# Altium schematic sheet H01R0_Frontend 1.SchDoc
size Letter; CompanyName: Hexabitz; DocumentNumber: 2; SheetNumber: 2; SheetTotal: 3
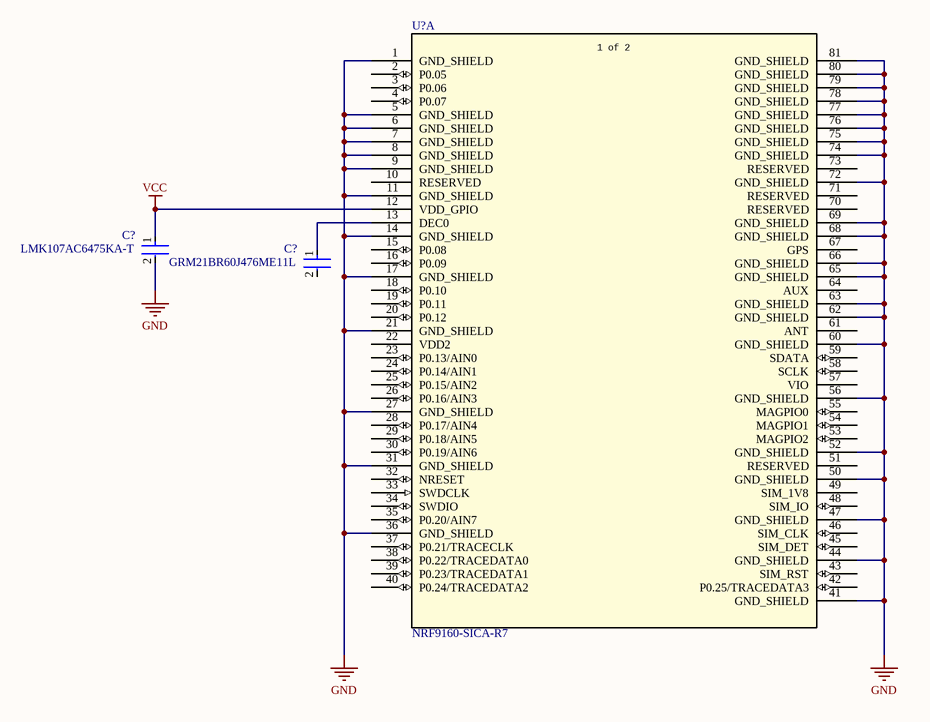
[diagram p0: H01R0_Frontend 1.SchDoc]

## Parts
(Parts that share a designator on the sheet are numbered #1, #2 ... from top to bottom, then left to right.)
C?#1  LMK107AC6475KA-T  [FP-0603-L_1_6_0_15-W_0_8-MFG]
C?#2  GRM21BR60J476ME11L  [FP-GRM21B-0_2-e0_2_0_7-IPC_B]
U?  NRF9160-SICA-R7  [LGA127_16p00X10p50_nRF9160_NOR]  (part A of 2)

## Nets
GND: C?#1.2 U?.1(GND_SHIELD) U?.5(GND_SHIELD) U?.6(GND_SHIELD) U?.7(GND_SHIELD) U?.8(GND_SHIELD) U?.9(GND_SHIELD) U?.11(GND_SHIELD) U?.14(GND_SHIELD) U?.17(GND_SHIELD) U?.21(GND_SHIELD) U?.27(GND_SHIELD) U?.31(GND_SHIELD) U?.36(GND_SHIELD) U?.41(GND_SHIELD) U?.44(GND_SHIELD) U?.47(GND_SHIELD) U?.50(GND_SHIELD) U?.52(GND_SHIELD) U?.56(GND_SHIELD) U?.60(GND_SHIELD) U?.62(GND_SHIELD) U?.63(GND_SHIELD) U?.65(GND_SHIELD) U?.66(GND_SHIELD) U?.68(GND_SHIELD) U?.69(GND_SHIELD) U?.72(GND_SHIELD) U?.74(GND_SHIELD) U?.75(GND_SHIELD) U?.76(GND_SHIELD) U?.77(GND_SHIELD) U?.78(GND_SHIELD) U?.79(GND_SHIELD) U?.80(GND_SHIELD) U?.81(GND_SHIELD)
VCC: C?#1.1 U?.12(VDD_GPIO)
NetC?#2_1: C?#2.1 U?.13(DEC0)

Not connected (* = marked no-connect by the designer): C?#2 2; U? 2(P0.05) 3(P0.06) 4(P0.07) 10(RESERVED) 15(P0.08) 16(P0.09) 18(P0.10) 19(P0.11) 20(P0.12) 22(VDD2) 23(P0.13/AIN0) 24(P0.14/AIN1) 25(P0.15/AIN2) 26(P0.16/AIN3) 28(P0.17/AIN4) 29(P0.18/AIN5) 30(P0.19/AIN6) 32(NRESET) 33(SWDCLK) 34(SWDIO) 35(P0.20/AIN7) 37(P0.21/TRACECLK) 38(P0.22/TRACEDATA0) 39(P0.23/TRACEDATA1) 40(P0.24/TRACEDATA2) 42(P0.25/TRACEDATA3) 43(SIM_RST) 45(SIM_DET) 46(SIM_CLK) 48(SIM_IO) 49(SIM_1V8) 51(RESERVED) 53(MAGPIO2) 54(MAGPIO1) 55(MAGPIO0) 57(VIO) 58(SCLK) 59(SDATA) 61(ANT) 64(AUX) 67(GPS) 70(RESERVED) 71(RESERVED) 73(RESERVED)

## Notes on the sheet
- Module:
- Title:
- Description:
- Size:
- Revision:
- Letter
- www.hexabitz.com
- Date:
- Time:
- Sheet
- of
- (in symbol CMP-006-000000-1, part A) 1 of 2

## Library data of the parts
C?#1 = CMP-14477-003024-3: Ceramic Capacitor General Use 4.7uF ±10% 10V X6S 0603; NexarPartId: 75346097; Capacitance: 4.7µF; Material: Ceramic; Voltage Rating (DC): 10V; Case/Package: 0603; Height: 950µm; Max Operating Temperature: 105°C; RoHS: Non-Compliant; Tolerance: 10%; Min Operating Temperature: -55°C; Voltage Rating: 10V
C?#2 = CMP-06035-028650-1: Chip Multilayer Ceramic Capacitors for General Purpose, 0805, 47uF, X5R, 15%, 20%, 6.3V; Tolerance: 20%; Case/Package: 0805; Length: 2mm; Thickness: 1.25mm; Dielectric: X5R; Width: 1.25mm; Capacitance: 47uF; Voltage Rating (DC): 6.3V
U? = CMP-006-000000-1: Description; Manufacturer_Name: Nordic Semiconductor; Type: RF; Manufacturer_Part_Number: NRF9160-SICA-R7; RefDes: RefDes; Design Item ID: NRF9160-SICA-R7; Source: NRF9160-SICA-R7.SchLib; Copyright: Copyright (C) 2025 Ultra Librarian. All rights reserved.